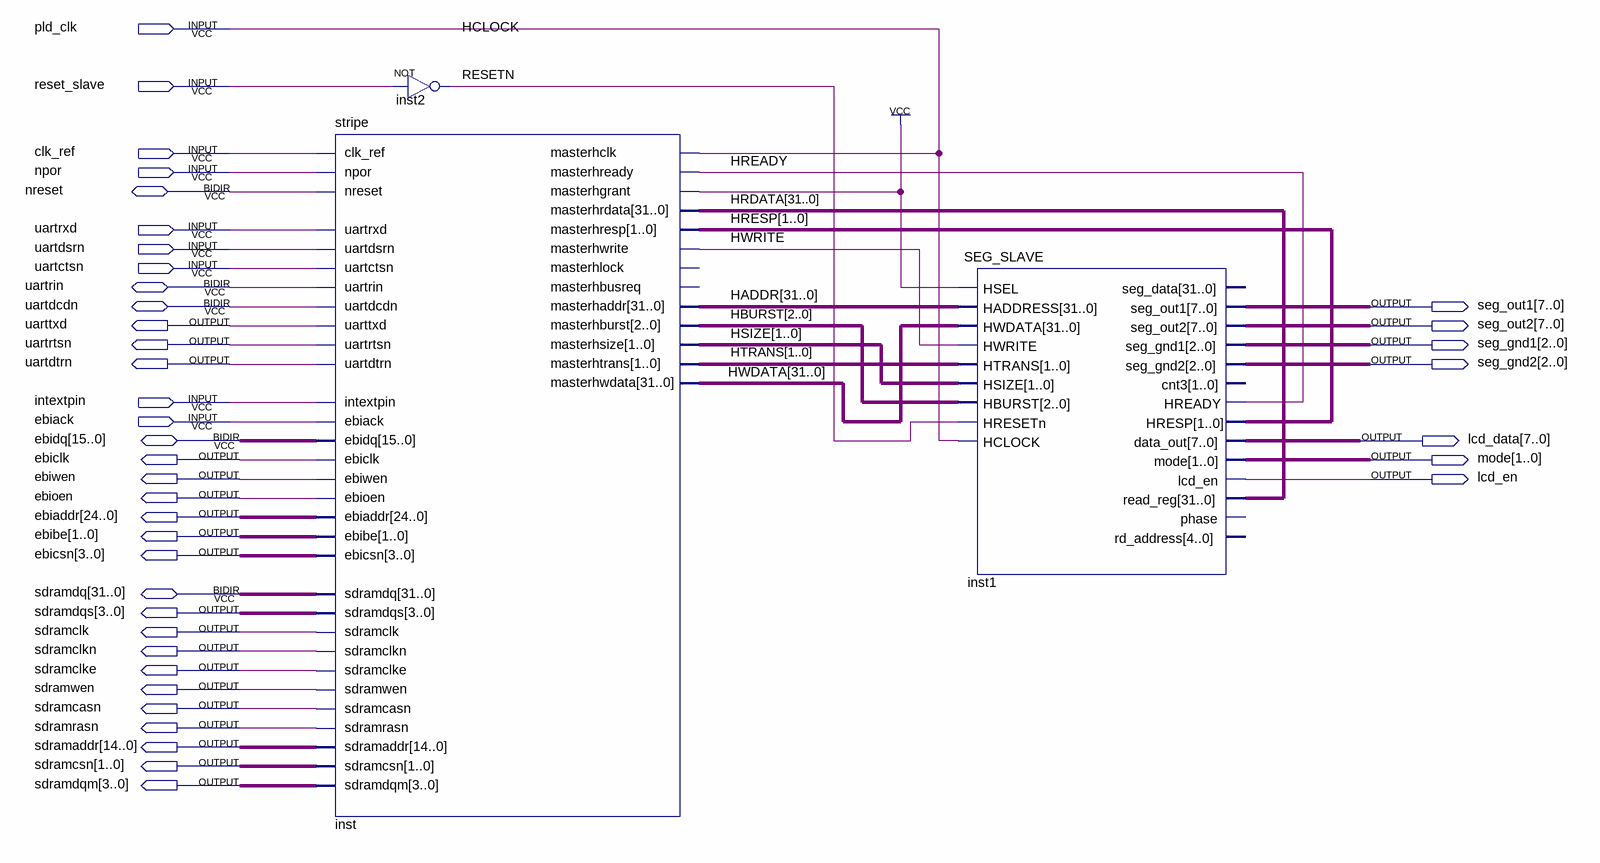
[diagram p0: schematic sheet]
// Quartus schematic arm_top.bdf as structural Verilog: 3 symbols, 40 pins
module arm_top (
  input  pld_clk,
  input  reset_slave,
  input  clk_ref,
  input  npor,
  input  uartrxd,
  input  uartdsrn,
  input  uartctsn,
  input  intextpin,
  input  ebiack,
  inout  nreset,
  inout  uartrin,
  inout  uartdcdn,
  inout  [15:0] ebidq,
  inout  [31:0] sdramdq,
  output [7:0] seg_out1,
  output uarttxd,
  output [7:0] seg_out2,
  output uartrtsn,
  output [2:0] seg_gnd1,
  output uartdtrn,
  output [2:0] seg_gnd2,
  output [7:0] lcd_data,
  output ebiclk,
  output [1:0] mode,
  output ebiwen,
  output lcd_en,
  output ebioen,
  output [24:0] ebiaddr,
  output [1:0] ebibe,
  output [3:0] ebicsn,
  output [3:0] sdramdqs,
  output sdramclk,
  output sdramclkn,
  output sdramclke,
  output sdramwen,
  output sdramcasn,
  output sdramrasn,
  output [14:0] sdramaddr,
  output [1:0] sdramcsn,
  output [3:0] sdramdqm
);

  wire HREADY, HWRITE, RESETN;
  wire [1:0] HRESP, HSIZE, HTRANS;
  wire [2:0] HBURST;
  wire [31:0] HADDR, HRDATA, HWDATA;

  stripe inst (
    .clk_ref(clk_ref), .npor(npor), .uartrxd(uartrxd), .uartdsrn(uartdsrn), .uartctsn(uartctsn),
    .intextpin(intextpin), .ebiack(ebiack), .masterhclk(pld_clk), .masterhready(HREADY), .masterhgrant(1'b1),
    .masterhrdata(HRDATA), .masterhresp(HRESP), .uarttxd(uarttxd), .uartrtsn(uartrtsn), .uartdtrn(uartdtrn),
    .ebiclk(ebiclk), .ebiwen(ebiwen), .ebioen(ebioen), .ebiaddr(ebiaddr), .ebibe(ebibe), .ebicsn(ebicsn),
    .sdramclk(sdramclk), .sdramclkn(sdramclkn), .sdramclke(sdramclke), .sdramwen(sdramwen),
    .sdramcasn(sdramcasn), .sdramrasn(sdramrasn), .sdramaddr(sdramaddr), .sdramcsn(sdramcsn),
    .sdramdqm(sdramdqm), .masterhwrite(HWRITE), .masterhaddr(HADDR), .masterhburst(HBURST),
    .masterhsize(HSIZE), .masterhtrans(HTRANS), .masterhwdata(HWDATA), .nreset(nreset), .uartrin(uartrin),
    .uartdcdn(uartdcdn), .ebidq(ebidq), .sdramdq(sdramdq), .sdramdqs(sdramdqs));  // open: masterhlock, masterhbusreq
  not inst2 (RESETN, reset_slave);
  SEG_SLAVE inst1 (
    .HSEL(1'b1), .HADDRESS(HADDR), .HWDATA(HWDATA), .HWRITE(HWRITE), .HTRANS(HTRANS), .HSIZE(HSIZE),
    .HBURST(HBURST), .HRESETn(RESETN), .HCLOCK(pld_clk), .seg_out1(seg_out1), .seg_out2(seg_out2),
    .seg_gnd1(seg_gnd1), .seg_gnd2(seg_gnd2), .HREADY(HREADY), .HRESP(HRESP), .data_out(lcd_data),
    .mode(mode), .lcd_en(lcd_en), .read_reg(HRDATA));  // open: seg_data, cnt3, phase, rd_address

  // Other names for the same wires on the sheet: HCLOCK = pld_clk
endmodule
